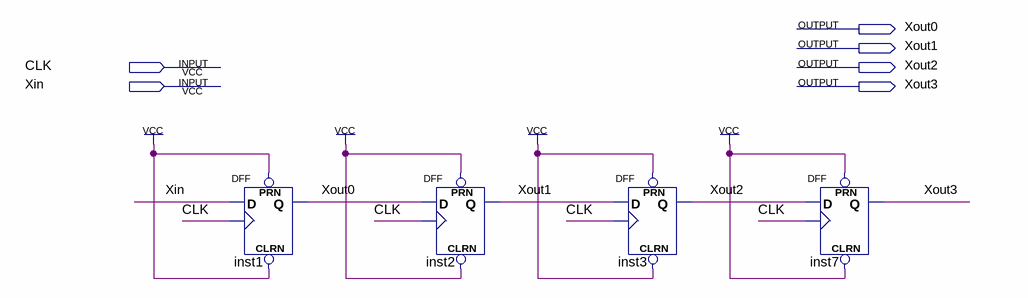
[diagram p0: schematic sheet]
// Quartus schematic Shifts.bdf as structural Verilog: 4 symbols, 6 pins
module Shifts (
  input  CLK,
  input  Xin,
  output Xout0,
  output Xout1,
  output Xout2,
  output Xout3
);

  DFF inst1 (.CLRN(1'b1), .CLK(CLK), .D(Xin), .PRN(1'b1), .Q(Xout0));
  DFF inst2 (.CLRN(1'b1), .CLK(CLK), .D(Xout0), .PRN(1'b1), .Q(Xout1));
  DFF inst3 (.CLRN(1'b1), .CLK(CLK), .D(Xout1), .PRN(1'b1), .Q(Xout2));
  DFF inst7 (.CLRN(1'b1), .CLK(CLK), .D(Xout2), .PRN(1'b1), .Q(Xout3));
endmodule
